# EAGLE design untitled (EAGLE 7.7.0)
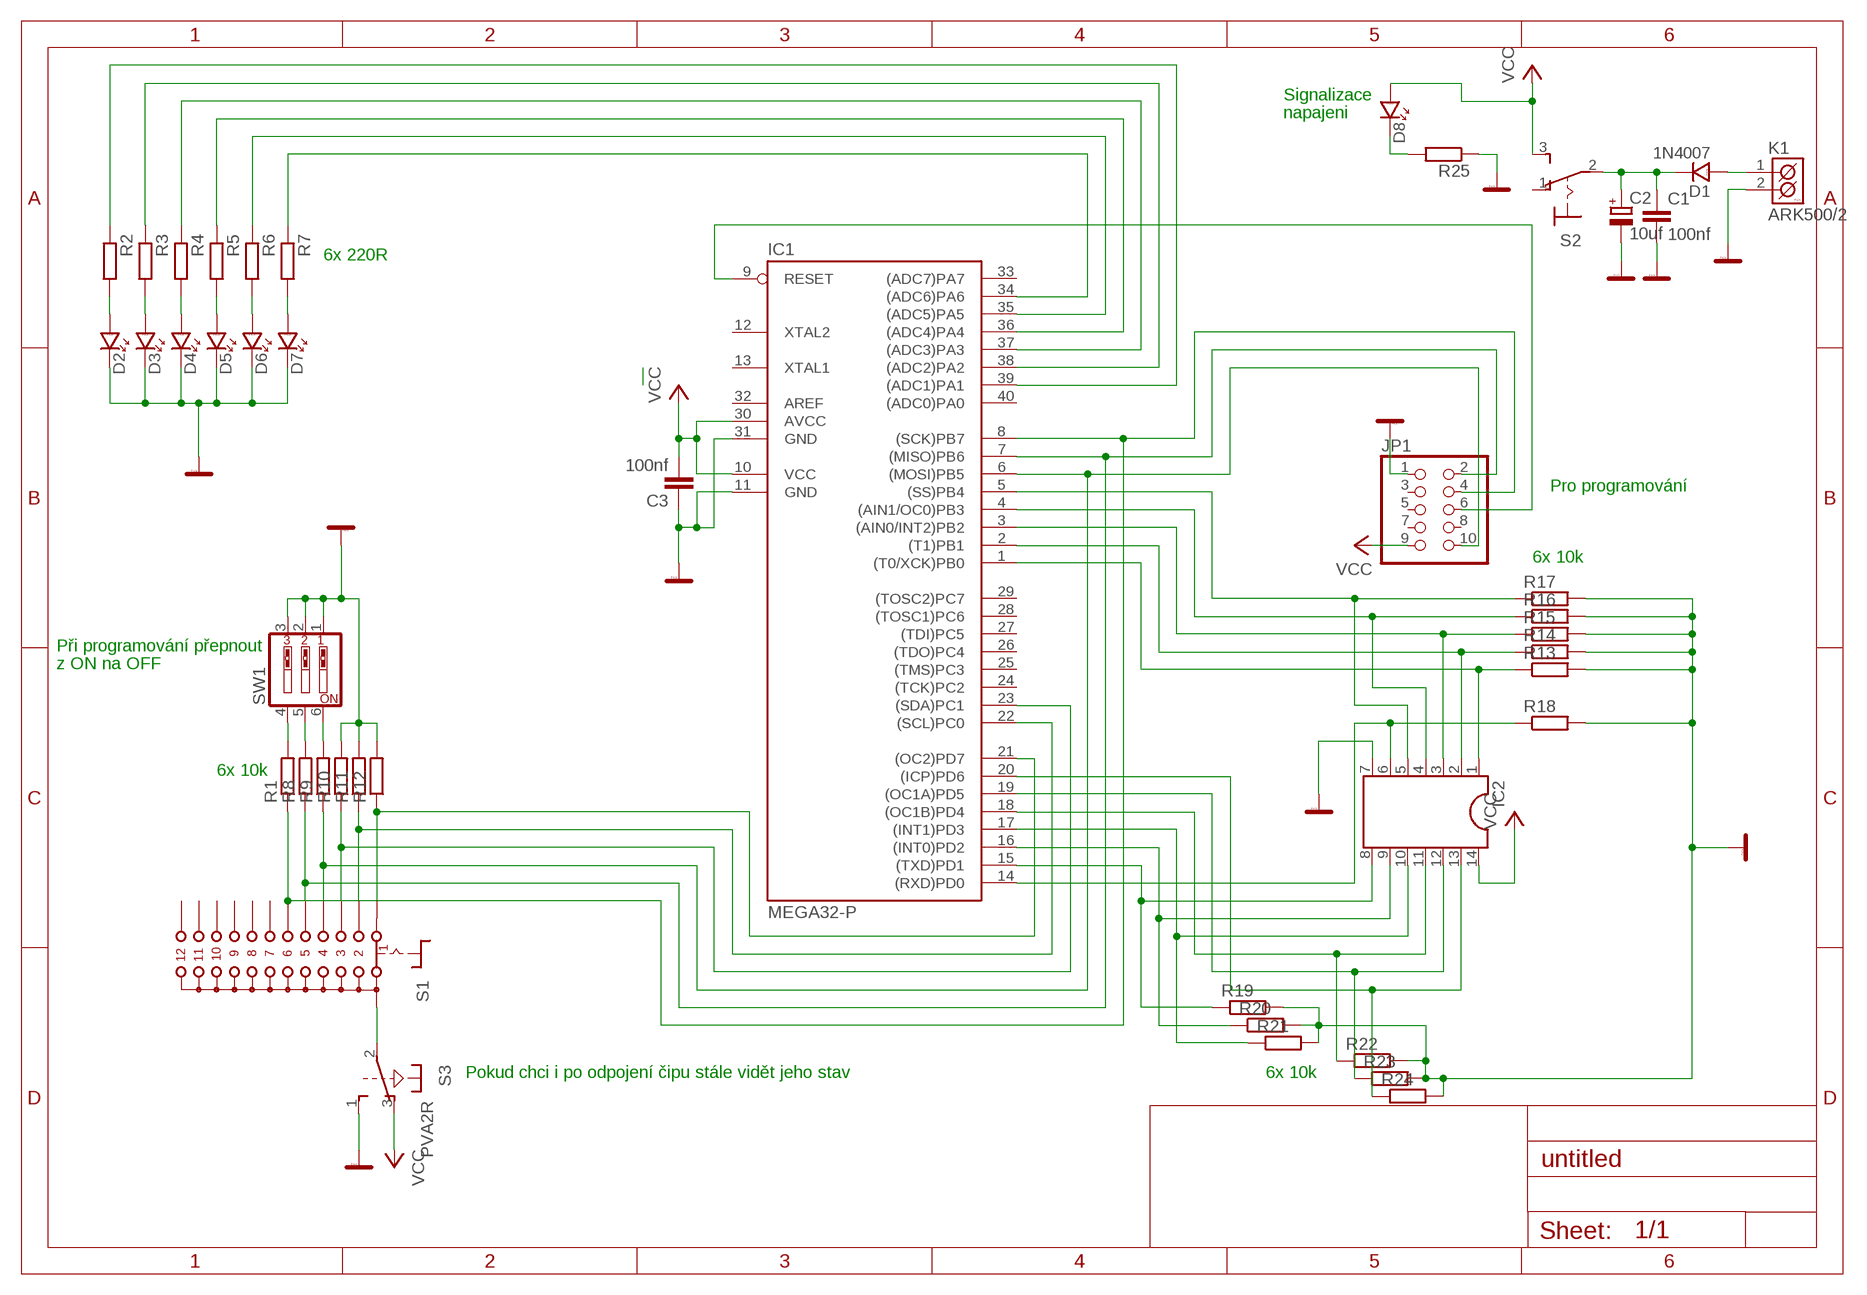
[diagram p0: schematic, sheet 1]

## Parts
C1  100nf  C-EU050-025X075  [C050-025X075]
C2  10uf  CPOL-EUE5-8.5  [E5-8,5]
C3  100nf  C-EU050-025X075  [C050-025X075]
D1  1N4007  [DO41]
D2  LED_5  [LED_5]
D3  LED_5  [LED_5]
D4  LED_5  [LED_5]
D5  LED_5  [LED_5]
D6  LED_5  [LED_5]
D7  LED_5  [LED_5]
D8  LED_5  [LED_5]
IC1  MEGA32-P  [DIL40]
IC2  DIL14  [DIL14]
JP1  PINHD-2X5  [2X05]
K1  ARK500/2  [ARK500/2]
R1  R-EU_0207/10  [0207/10]
R2  R-EU_0207/10  [0207/10]
R3  R-EU_0207/10  [0207/10]
R4  R-EU_0207/10  [0207/10]
R5  R-EU_0207/10  [0207/10]
R6  R-EU_0207/10  [0207/10]
R7  R-EU_0207/10  [0207/10]
R8  R-EU_0207/10  [0207/10]
R9  R-EU_0207/10  [0207/10]
R10  R-EU_0207/10  [0207/10]
R11  R-EU_0207/10  [0207/10]
R12  R-EU_0207/10  [0207/10]
R13  R-EU_0207/10  [0207/10]
R14  R-EU_0207/10  [0207/10]
R15  R-EU_0207/10  [0207/10]
R16  R-EU_0207/10  [0207/10]
R17  R-EU_0207/10  [0207/10]
R18  R-EU_0207/10  [0207/10]
R19  R-EU_0207/10  [0207/10]
R20  R-EU_0207/10  [0207/10]
R21  R-EU_0207/10  [0207/10]
R22  R-EU_0207/10  [0207/10]
R23  R-EU_0207/10  [0207/10]
R24  R-EU_0207/10  [0207/10]
R25  R-EU_0207/10  [0207/10]
S1  CK101X12  [CK101X12]
S2  320-916  [320-916]
S3  PVA2R  [PVA2R]
SW1  SW_DIP-3  [EDG-03]

## Nets
GND: C1.2 C2.- C3.1 D2.K D3.K D4.K D5.K D6.K D7.K IC1.11(GND) IC1.31(GND) IC2.7 JP1.1 K1.2(K2) R10.2 R11.2 R12.2 R13.2 R14.2 R15.2 R16.2 R17.2 R18.2 R19.2 R20.2 R21.2 R22.2 R23.2 R24.2 R25.1 S3.1(1:S) SW1.1 SW1.2 SW1.3
N$1: R1.2 SW1.4
N$3: D2.A R2.2
N$4: D3.A R3.2
N$5: D4.A R4.2
N$6: S1.A S3.2(1:P)
N$7: IC1.1((T0/XCK)PB0) IC2.1 R13.1
N$8: IC1.8((SCK)PB7) JP1.4 R1.1 S1.6
N$9: IC1.9(RESET) JP1.6
N$10: D5.A R5.2
N$11: R8.2 SW1.5
N$12: R9.2 SW1.6
N$13: D6.A R6.2
N$14: D7.A R7.2
N$15: IC1.39((ADC1)PA1) R2.1
N$16: IC1.38((ADC2)PA2) R3.1
N$17: IC1.37((ADC3)PA3) R4.1
N$18: IC1.36((ADC4)PA4) R5.1
N$19: IC1.35((ADC5)PA5) R6.1
N$20: IC1.34((ADC6)PA6) R7.1
N$21: IC1.2((T1)PB1) IC2.2 R14.1
N$22: IC1.7((MISO)PB6) JP1.2 R8.1 S1.5
N$23: IC1.6((MOSI)PB5) JP1.10 R9.1 S1.4
N$24: IC1.23((SDA)PC1) R10.1 S1.3
N$25: IC1.22((SCL)PC0) R11.1 S1.2
N$26: IC1.21((OC2)PD7) R12.1 S1.1
N$27: IC1.3((AIN0/INT2)PB2) IC2.3 R15.1
N$28: IC1.4((AIN1/OC0)PB3) IC2.4 R16.1
N$29: IC1.5((SS)PB4) IC2.5 R17.1
N$30: IC1.14((RXD)PD0) IC2.6 R18.1
N$31: C1.1 C2.+ D1.K S2.2(P)
N$32: D1.A K1.1(K1)
N$33: IC1.15((TXD)PD1) IC2.8 R19.1
N$34: IC1.16((INT0)PD2) IC2.9 R20.1
N$35: IC1.17((INT1)PD3) IC2.10 R21.1
N$36: IC1.18((OC1B)PD4) IC2.11 R22.1
N$37: IC1.19((OC1A)PD5) IC2.12 R23.1
N$38: IC1.20((ICP)PD6) IC2.13 R24.1
N$39: D8.K R25.2
VCC: C3.2 D8.A IC1.10(VCC) IC1.30(AVCC) IC2.14 JP1.9 S2.3(S) S3.3(1:O)
Unconnected: IC1.12(XTAL2) IC1.13(XTAL1) IC1.24((TCK)PC2) IC1.25((TMS)PC3) IC1.26((TDO)PC4) IC1.27((TDI)PC5) IC1.28((TOSC1)PC6) IC1.29((TOSC2)PC7) IC1.32(AREF) IC1.33((ADC7)PA7) IC1.40((ADC0)PA0) JP1.3 JP1.5 JP1.7 JP1.8 S1.7 S1.8 S1.9 S1.10 S1.11 S1.12 S2.1(O) S3.4(2:S) S3.5(2:P) S3.6(2:O)

## Notes on the sheet
- Signalizace
- napajeni
- 6x 220R
- Pro programování
- 6x 10k
- Při programování přepnout
- z ON na OFF
- 6x 10k
- Pokud chci i po odpojení čipu stále vidět jeho stav | 6x 10k

## Library data of the parts
C1 C3 = rcl:C-EU: CAPACITOR, European symbol
C2 = rcl:CPOL-EU: POLARIZED CAPACITOR, European symbol
D1 = #PaJa_31:1N4007: Usmernovaci dioda - 1A, 1000V
D2-D8 = #PaJa_31:LED: LED - jednobarevna
IC1 = atmel:MEGA32-P: MICROCONTROLLER 32 Kbytes FLASH 2 Kbytes SRAM 1 Kbytes EEPROM USART 8-channel 10 bit ADC Source: www.atmel.com .. doc2503.pdf; MPN: ATMEGA32-16PU; OC_FARNELL: 1661729; OC_NEWARK: 51P1794
IC2 = ic-package:DIL14: Dual In Line / Socket
JP1 = pinhead:PINHD-2X5: PIN HEADER
K1 = #PaJa_konektory:ARK500/2: Svorkovnice - roztec 5mm - dvojita
R1 R8-R25 = resistor:R-EU_: RESISTOR, European symbol
R2-R7 = rcl:R-EU_: RESISTOR, European symbol
S1 = switch:CK101X12: ROTARY SWITCH C&K
S2 = switch:320-916: TOGGLE SWITCH distributor RS Components
S3 = switch-misc:PVA2R: ITT SWITCH
SW1 = special:SW_DIP-3: DIP SWITCH

## Board
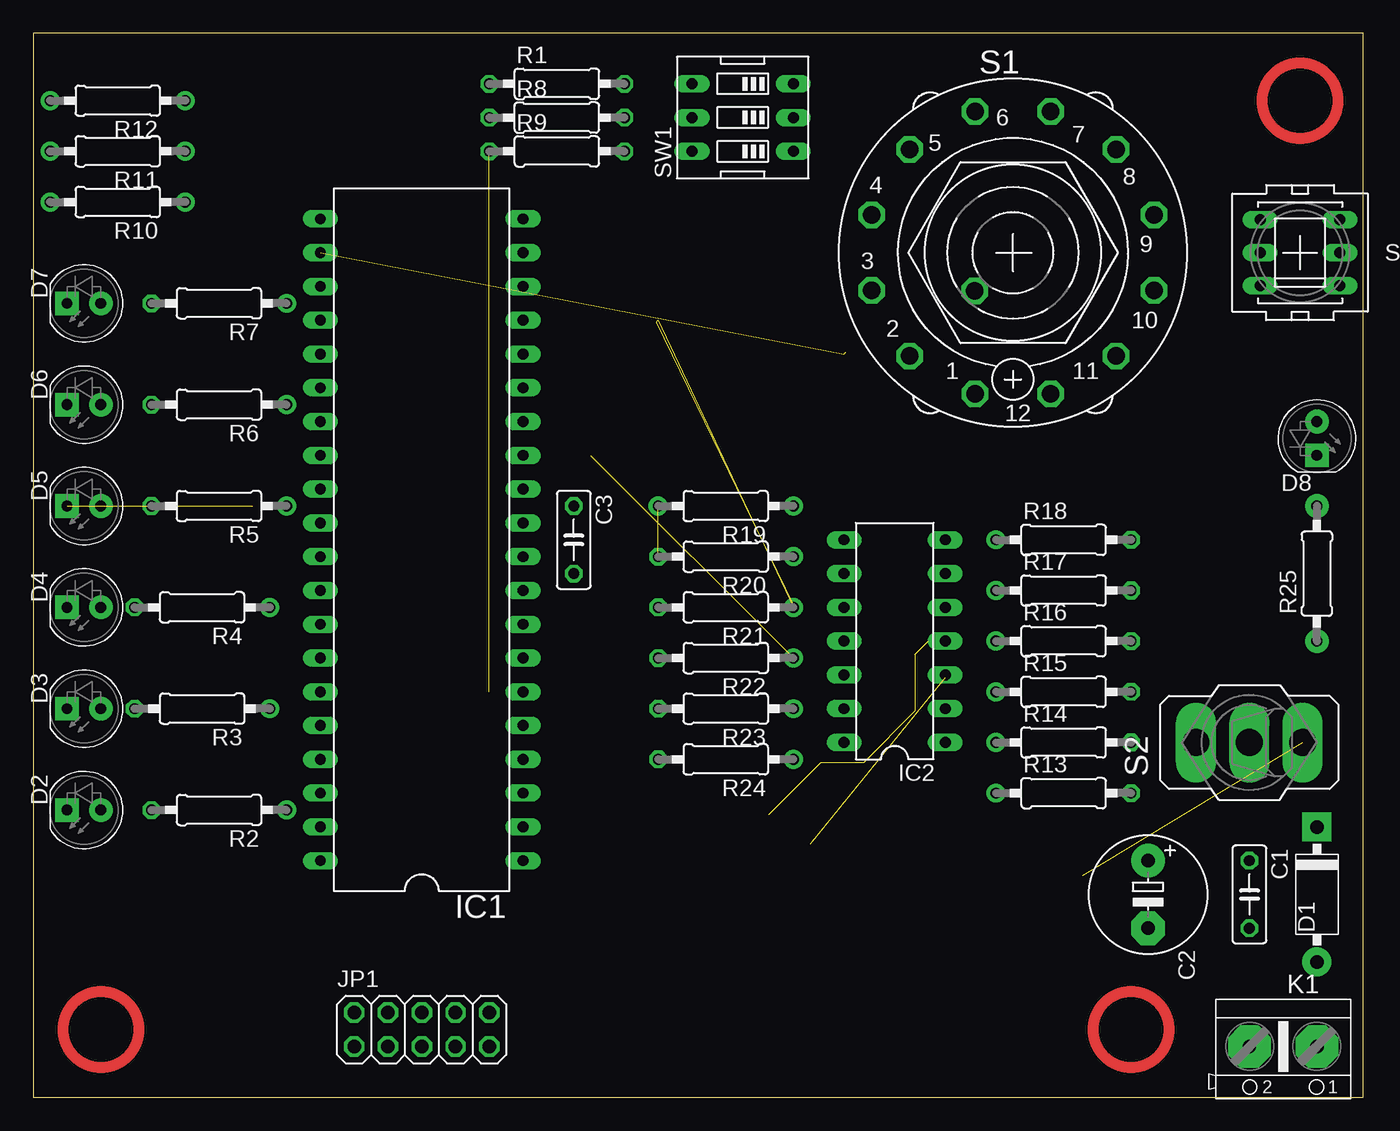
[diagram p1: board, top side]
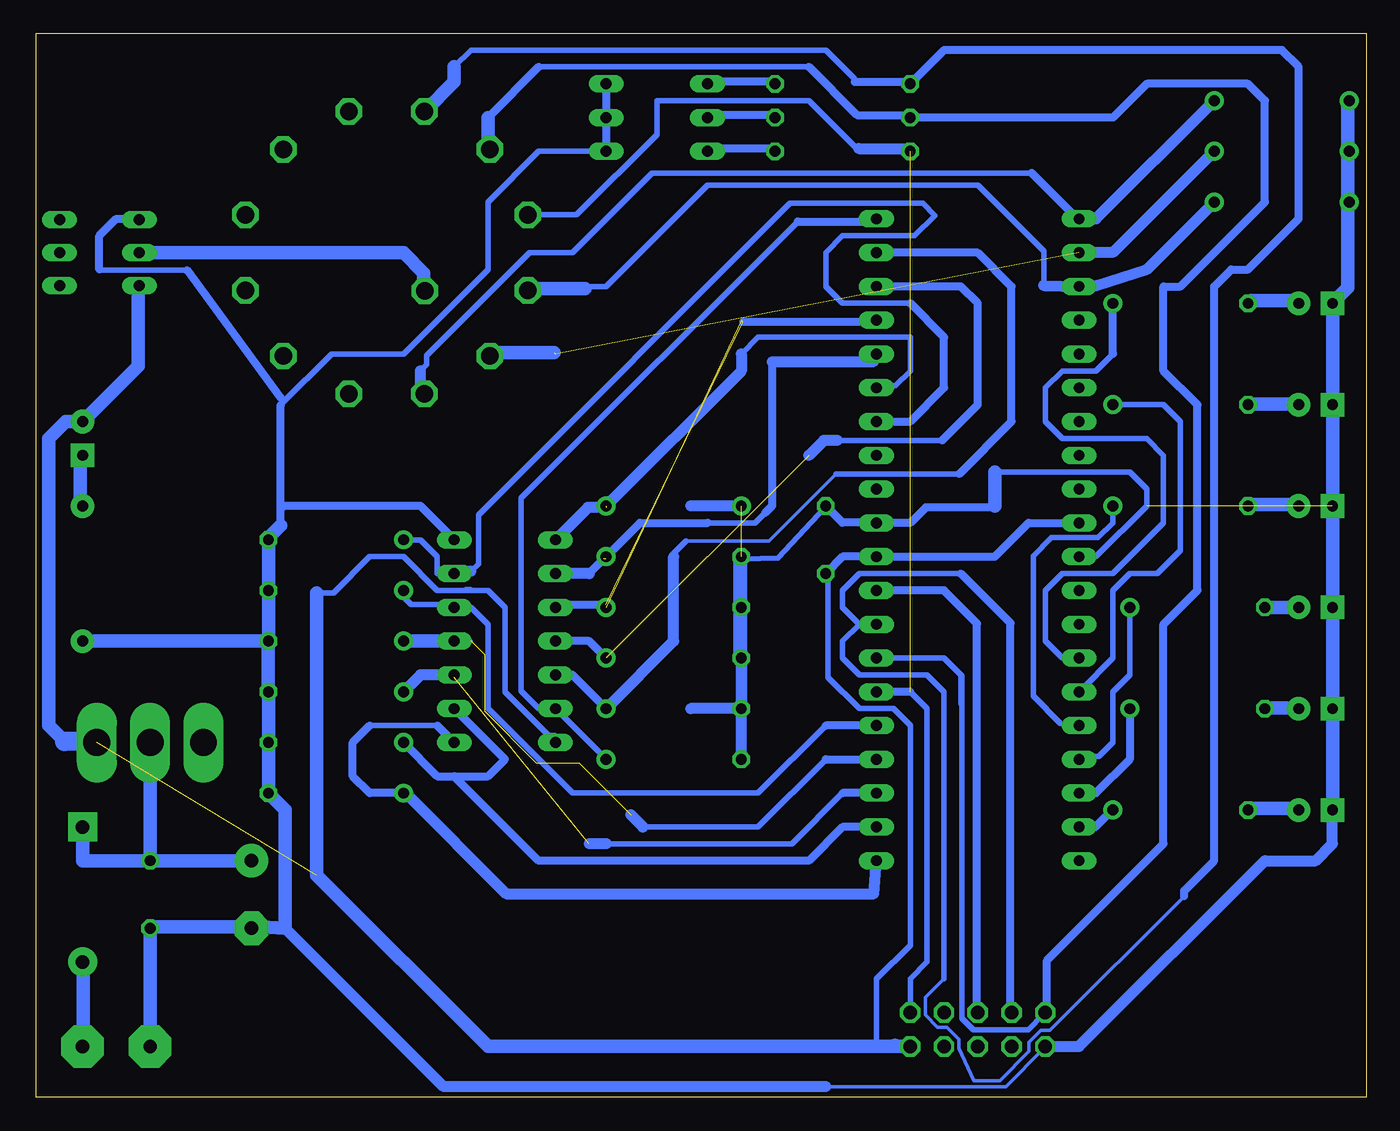
[diagram p2: board, bottom side, seen from below]

Size 100 x 80 mm. Coordinates in mm from the lower left corner, seen from the top.
Outline: 0,0 100,0 100,80 0,80 0,0
Copper layers (1*16): Top 0.035mm / dielectric 1.5mm / Bottom 0.035mm
Design rules "default": minimum track width 10mil, minimum drill 24mil, track to track 8mil, track to pad 8mil, pad to pad 8mil, via to via 8mil, smd to smd 8mil, copper to edge 40mil, drill to drill 8mil, minimum pad ring 10mil, minimum via ring 8mil, stop-mask expansion 4mil, vias tented up to drill 0mil, thermal gap 10mil

### Footprints (pad centres in the part's own frame; a part is rotated, then mirrored left to right if it is on the bottom)
C050-025X075 = drill 0.813 octagon: 1 -2.54,0; 2 2.54,0
E5-8,5 = drill 1.016 pad 2.54: + -2.54,0 | drill 1.016 pad 2.54 octagon: - 2.54,0
DO41 = drill 1.016 pad 2.184: A -5.08,0 | drill 1.016 pad 2.184 square: K 5.08,0
LED_5 = drill 0.813 pad 1.778: A -1.27,0 | drill 0.813 pad 1.778 square: K 1.27,0
DIL40 = drill 0.813 long: 1 -24.13,-7.62; 2 -21.59,-7.62; 3 -19.05,-7.62; 4 -16.51,-7.62; 5 -13.97,-7.62; 6 -11.43,-7.62; 7 -8.89,-7.62; 8 -6.35,-7.62; 9 -3.81,-7.62; 10 -1.27,-7.62; 11 1.27,-7.62; 12 3.81,-7.62; 13 6.35,-7.62; 14 8.89,-7.62; 15 11.43,-7.62; 16 13.97,-7.62; 17 16.51,-7.62; 18 19.05,-7.62; 19 21.59,-7.62; 20 24.13,-7.62; 21 24.13,7.62; 22 21.59,7.62; 23 19.05,7.62; 24 16.51,7.62; 25 13.97,7.62; 26 11.43,7.62; 27 8.89,7.62; 28 6.35,7.62; 29 3.81,7.62; 30 1.27,7.62; 31 -1.27,7.62; 32 -3.81,7.62; 33 -6.35,7.62; 34 -8.89,7.62; 35 -11.43,7.62; 36 -13.97,7.62; 37 -16.51,7.62; 38 -19.05,7.62; 39 -21.59,7.62; 40 -24.13,7.62
DIL14 = drill 0.813 long: 1 -7.62,-3.81; 2 -5.08,-3.81; 3 -2.54,-3.81; 4 0,-3.81; 5 2.54,-3.81; 6 5.08,-3.81; 7 7.62,-3.81; 8 7.62,3.81; 9 5.08,3.81; 10 2.54,3.81; 11 0,3.81; 12 -2.54,3.81; 13 -5.08,3.81; 14 -7.62,3.81
2X05 = drill 1.016 octagon: 1 -5.08,-1.27; 2 -5.08,1.27; 3 -2.54,-1.27; 4 -2.54,1.27; 5 0,-1.27; 6 0,1.27; 7 2.54,-1.27; 8 2.54,1.27; 9 5.08,-1.27; 10 5.08,1.27
ARK500/2 = drill 1 pad 3.2 octagon: 1 -2.54,0; 2 2.54,0
0207/10 = drill 0.813 octagon: 1 -5.08,0; 2 5.08,0
CK101X12 = drill 1.321 octagon: 1 -2.845,-10.617; 2 -7.772,-7.772; 3 -10.617,-2.845; 4 -10.617,2.845; 5 -7.772,7.772; 6 -2.845,10.617; 7 2.845,10.617; 8 7.772,7.772; 9 10.617,2.845; 10 10.617,-2.845; 11 7.772,-7.772; 12 2.845,-10.617; A -2.87,-2.87
320-916 = drill 2.007 long: 1 0,4.013; 2 0,0; 3 0,-4.013
PVA2R = drill 0.813 long: 1 -2.997,2.489; 2 -2.997,0; 3 -2.997,-2.489; 4 2.997,2.489; 5 2.997,0; 6 2.997,-2.489
EDG-03 = drill 0.813 long: 1 -2.54,-3.81; 2 0,-3.81; 3 2.54,-3.81; 4 2.54,3.81; 5 0,3.81; 6 -2.54,3.81

### Placement (x,y rotation side)
C1  91.44,15.24 270 top
C2  83.82,15.24 270 top
C3  40.64,41.91 270 top
D1  96.52,15.24 90 top
D2  3.81,21.59 180 top
D3  3.81,29.21 180 top
D4  3.81,36.83 180 top
D5  3.81,44.45 180 top
D6  3.81,52.07 180 top
D7  3.81,59.69 180 top
D8  96.52,49.53 270 top
IC1  29.21,41.91 90 top
IC2  64.77,34.29 90 top
JP1  29.21,5.08 0 top
K1  93.98,3.81 180 top
R1  39.37,76.2 0 top
R2  13.97,21.59 180 top
R3  12.7,29.21 180 top
R4  12.7,36.83 180 top
R5  13.97,44.45 180 top
R6  13.97,52.07 180 top
R7  13.97,59.69 180 top
R8  39.37,73.66 0 top
R9  39.37,71.12 0 top
R10  6.35,67.31 180 top
R11  6.35,71.12 180 top
R12  6.35,74.93 180 top
R13  77.47,22.86 0 top
R14  77.47,26.67 0 top
R15  77.47,30.48 0 top
R16  77.47,34.29 0 top
R17  77.47,38.1 0 top
R18  77.47,41.91 0 top
R19  52.07,44.45 180 top
R20  52.07,40.64 180 top
R21  52.07,36.83 180 top
R22  52.07,33.02 180 top
R23  52.07,29.21 180 top
R24  52.07,25.4 180 top
R25  96.52,39.37 90 top
S1  73.66,63.5 0 top
S2  91.44,26.67 90 top
S3  95.25,63.5 0 top
SW1  53.34,73.66 90 top

### Tracks (layer width: path | path; a pad name or v marks a point on that pad's centre or on a via)
GND  (2 unrouted)
  Bottom 0.254: 1.37,67.44 R10.2 1.37,67.21 | 1.37,71.09 R11.2 1.37,71.32 | 1.37,74.75 R12.2 | 2.52,37.03 D4.K | 2.52,44.35 D5.K 2.52,44.58 | 2.52,51.89 D6.K 2.52,52.12 | 2.52,59.66 D7.K 2.52,59.89 | 24,3.89 JP1.1 24.23,3.66 27.1,0.79 40.64,0.79 | 2.74,21.49 D2.K 2.52,21.72 | 2.52,29.03 D3.K 2.52,29.26 | 40.46,44.35 C3.1 40.69,44.35 | 37.03,43.2 IC1.11 | 47.09,33.15 R22.2 | 47.09,36.8 R21.2 47.09,37.03 | 47.09,40.46 R20.2 46.86,40.46 | 91.44,12.8 C1.2 | 83.9,12.8 C2.- | 82.53,26.52 R14.2 82.53,26.75 | 82.53,30.63 R15.2 82.53,30.4 | 82.53,38.18 R17.2 82.53,37.95 | 82.53,41.83 R18.2 82.53,42.06 | 81.61,42.98 81.61,43.18 | 81.61,52.07 81.61,52.58 | 92.35,65.84 S3.1 | 82.53,34.29 R16.2 | 82.07,22.4 82.53,22.86 R13.2 | 83.67,12.8 C2.- | 83.67,12.57 C2.-
  Bottom 0.406: 40.69,44.35 44.25,40.54 46.86,40.46 | IC2.7 68.73,42.06 | SW1.1 62.23,71.12 66.04,67.31 66.04,62.23 72.39,55.88 77.8,55.88 81.61,52.07 | IC1.31 20.32,40.64 16.51,44.45 16.51,45.72 17.78,46.99 27.94,46.99 | 81.61,43.18 81.61,44.12 81.28,44.45 | 88.67,62.18 95.2,62.18 95.25,62.23 | 92.3,66.04 S3.1
  Bottom 0.61: 81.61,52.58 88.67,62.18 | 81.61,43.18 81.61,52.07 | SW1.3 SW1.2 SW1.1 | 27.94,44.45 28.04,44.35 33.12,44.35 34.29,43.18 IC1.11 | 95.25,62.23 95.25,64.77 93.98,66.04 92.3,66.04 | 68.58,42.06 68.73,42.06 71.12,44.45 81.28,44.45 | 37.03,43.2 39.4,43.2 C3.1
  Bottom 0.813: JP1.1 21.59,3.81 7.62,17.78 3.81,17.78 2.54,19.05 D2.K | 40.64,0.79 69.37,0.79 81.28,12.7 | R24.2 R23.2 | R23.2 R22.2 | R19.2 50.8,44.45 | R20.2 R23.2 | R23.2 50.8,29.21
  Bottom 1.016: 1.37,74.75 1.37,71.22 R11.2 | 1.37,71.09 1.37,67.41 R10.2 | 1.37,67.21 1.37,60.86 D7.K | 2.52,59.66 2.52,52.09 D6.K | 2.52,21.72 2.52,29.18 D3.K | 2.52,29.26 2.52,36.8 D4.K | 2.52,37.03 2.52,44.42 D5.K 2.52,44.48 2.52,51.89 | 83.67,12.8 83.67,12.85 81.28,12.7 81.28,21.59 R13.2 | 82.53,22.86 82.53,26.64 R14.2 | 82.53,26.75 82.53,30.45 R15.2 R16.2 | 81.61,42.98 82.53,42.06 82.53,41.83 82.53,38.12 R17.2 | 82.53,37.95 82.53,34.31 R16.2 | R16.2 R25.1 | 47.09,33.15 47.09,36.73 R21.2 | 47.09,37.03 47.09,40.54 R20.2 | 83.9,12.8 91.34,12.8 C1.2 K1.2 | 27.94,44.45 27.94,46.99
N$1
  Bottom 0.254: 44.58,76.35 R1.2
  Bottom 0.61: 44.58,76.35 49.38,76.35 SW1.4
N$3
  Bottom 0.254: 8.69,21.72 R2.2 | 5.26,21.72 D2.A
  Bottom 1.016: 5.26,21.72 8.76,21.72 R2.2
N$4
  Bottom 0.254: 5.26,29.26 D3.A
  Bottom 1.016: 5.26,29.26 7.57,29.26 R3.2
N$5
  Bottom 1.016: D4.A R4.2
N$6
  Bottom 0.254: 92.13,63.32 S3.2 | 70.87,60.81 S1.A
  Bottom 1.016: 70.87,60.81 70.87,61.98 72.39,63.5 S3.2
N$7
  Bottom 0.254: 72.24,22.86 R13.1 72.47,22.86 | 68.58,26.75 IC2.1
  Bottom 0.406: 68.58,26.75 68.66,26.75 | 69.85,27.94 74.93,27.94
  Bottom 0.61: 68.66,26.75 69.85,27.94 | 72.47,22.86 74.93,22.86 76.2,24.13 76.2,26.67 74.93,27.94
  Bottom 0.813: 72.24,22.86 64.67,15.29 37.03,15.29 IC1.1
N$8
  Bottom 0.254: 26.75,6.4 JP1.4 | 13.69,15.11 23.77,5.03 24.46,5.03 25.38,4.12 25.38,3.43 27.56,1.25 29.49,1.25 30.63,3.66 30.63,4.34 31.55,5.26 32.23,5.26 33.15,6.17 33.15,7.49 31.75,8.89 | 34.29,76.35 R1.1 | 37.03,35.43 IC1.8
  Bottom 0.406: 30.48,39.37 38.1,39.37 39.37,38.1 39.37,36.83 38.1,35.56 | IC1.8 38.1,35.56 | 38.1,35.56 39.37,34.29 39.37,33.02 38.1,31.75 33.02,31.75 31.75,30.48 31.75,8.89 | 38.48,76.35 38.48,76.58 40.64,78.74 67.31,78.74 68.58,77.47
  Bottom 0.61: 38.48,76.35 34.29,76.35 | 26.75,6.4 26.75,35.64 30.48,39.37 | R1.1 31.75,78.74 6.35,78.74 5.08,77.47 5.08,66.04 8.89,62.23 10.16,62.23 11.43,60.96 11.43,17.78 13.69,15.52 13.69,15.11
  Bottom 1.016: 68.58,77.47 68.58,76.35 S1.6
N$9
  Bottom 0.254: 36.8,37.95 IC1.9 | 29.26,6.4 JP1.6
  Bottom 0.61: 29.26,6.4 29.26,35.61 31.75,38.1 IC1.9
N$10
  Bottom 0.254: 8.69,44.58 R5.2 | 5.26,44.58 D5.A
  Bottom 1.016: 5.26,44.58 8.76,44.58 R5.2
N$11
  Bottom 0.254: 44.58,73.84 R8.2 | 49.38,73.84 SW1.5
  Bottom 0.61: 44.58,73.84 49.35,73.84 SW1.5
N$12
  Bottom 0.254: 44.58,71.32 R9.2 | 49.38,71.32 SW1.6
  Bottom 0.61: 44.58,71.32 49.33,71.32 SW1.6
N$13
  Bottom 0.254: 8.69,52.12 R6.2 | 5.26,52.12 D6.A
  Bottom 1.016: 5.26,52.12 8.84,52.12 R6.2
N$14
  Bottom 0.254: 5.26,59.89 D7.A
  Bottom 1.016: 5.26,59.89 8.69,59.89 R7.2
N$15
  Bottom 0.254: 20.34,20.34 21.49,20.34 IC1.39 | 19.2,21.49 R2.1
  Bottom 0.61: 19.2,21.49 20.37,20.32 IC1.39
N$16
  Bottom 0.254: 17.93,29.03 R3.1 | 21.49,22.86 IC1.38
  Bottom 0.61: 17.93,29.03 17.78,28.88 17.78,25.4 20.32,22.86 IC1.38
N$17
  Bottom 0.254: 21.49,25.6 IC1.37
  Bottom 0.406: 21.49,25.6 20.12,25.6 19.05,26.67 19.05,30.48 17.78,31.75 R4.1
N$18
  Bottom 0.406: IC1.36 22.99,28.12 25.04,30.18 25.04,40.69 23.67,42.06 20.17,42.06 19.05,43.18 R5.1
N$19
  Bottom 0.254: 21.49,30.63 IC1.35 | 18.97,51.89 R6.1
  Bottom 0.406: R6.1 15.24,52.07 13.97,50.8 13.97,41.1 15.7,39.37 17.78,39.37 19.05,38.1 19.05,33.02 21.44,30.63 21.49,30.63
N$20
  Bottom 0.254: 19.2,59.66 R7.1
  Bottom 0.406: IC1.34 22.86,33.02 24.13,34.29 24.13,38.1 22.86,39.37 19.05,39.37 15.24,43.18 15.24,48.26 16.51,49.53 22.86,49.53 24.13,50.8 24.13,53.34 22.86,54.61 20.32,54.61 19.05,55.88
  Bottom 0.61: 19.05,55.88 R7.1
N$21
  Bottom 0.254: 72.24,26.52 R14.1
  Bottom 0.61: R14.1 69.85,24.13 68.58,24.13 | IC1.2 39.37,20.32 41.91,17.78 62.23,17.78 68.58,24.13 | 68.58,24.13 66.04,24.13 64.77,25.4 IC2.2
  Bottom 0.813: 68.58,29.03 IC2.2
N$22
  Bottom 0.254: 36.35,32.92 36.8,32.92 IC1.7 | 24.23,6.17 JP1.2 24,6.4 | 34.29,73.84 R8.1
  Bottom 0.406: 36.25,33.02 31.75,33.02 30.48,31.75 | 30.48,31.75 30.48,29.59 30.4,29.52 | 41.91,77.47 62.23,77.47 | 30.48,31.75 30.4,31.67 30.4,5.94 29.54,5.08 25.4,5.08 24.31,6.17 24.23,6.17
  Bottom 0.61: 34.29,73.84 38.28,73.84 41.91,77.47 | 34.11,73.84 R8.1 19.05,73.66 16.51,76.2 8.89,76.2 7.62,74.93 7.62,67.31 13.97,60.96 15.24,60.96 15.24,54.61 12.7,52.07 12.7,38.1 15.24,35.56 15.24,19.05 24,10.29 24,6.4 | 36.25,33.02 36.35,32.92 | 62.23,77.47 66.04,73.66
  Bottom 1.016: 66.04,73.66 66.04,71.42 S1.5
N$23  (1 unrouted)
  Bottom 0.254: 34.29,71.32 R9.1 | 36.35,30.4 36.8,30.4 IC1.6
  Bottom 0.406: S1.4 59.38,66.34 53.34,72.39 53.34,74.93 41.91,74.93 38.3,71.32 38.15,71.32 | JP1.10 34.29,8.89 33.02,10.16 33.02,29.21 34.29,30.48 | 36.27,30.48 36.35,30.4
  Bottom 0.61: 34.29,30.48 36.27,30.48
  Bottom 0.813: 38.15,71.32 34.29,71.32
N$24
  Bottom 0.254: 11.43,67.21 R10.1 | 21.49,61.04 IC1.23 | 62.87,60.81 S1.3
  Bottom 0.406: 24.26,61.04 24.26,63.63 29.21,68.58 49.53,68.58 57.15,60.96 58.57,60.96 58.73,60.81
  Bottom 0.813: 24.26,61.04 IC1.23 | 21.49,61.04 20.24,61.04 16.51,62.23 R10.1
  Bottom 1.016: 62.87,60.81 58.73,60.81
N$25  (2 unrouted)
  Bottom 0.254: 11.43,71.09 R11.1 | 21.49,63.55 IC1.22 | 65.84,55.78 S1.2
  Bottom 0.813: 65.84,55.78 66.04,55.98 | 21.49,63.55 19,63.55 R11.1
  Bottom 1.016: 66.04,55.98 61.06,55.98
N$26
  Bottom 0.254: 11.43,74.75 R12.1 | 21.49,66.06 IC1.21 21.72,66.06 | 70.64,53.03 S1.1
  Bottom 0.406: 71.12,54.61 70.64,55.09 70.64,55.78 62.92,63.5 59.69,63.5 53.7,69.49 25.15,69.49
  Bottom 0.61: 21.72,66.06 25.15,69.49
  Bottom 0.813: 70.64,53.03 71.12,53.52 71.12,54.61 | 11.43,74.75 11.61,74.75 20.32,66.04 IC1.21
N$27  (1 unrouted)
  Bottom 0.254: 72.24,30.63 R15.1 | 68.58,31.55 IC2.3
  Bottom 0.406: 39.37,22.86 43.18,19.05 57.15,19.05
  Bottom 0.61: IC1.3 39.37,22.86
  Bottom 0.813: 57.15,19.05 58.42,19.05 | IC2.3 71.12,31.75 R15.1
N$28  (5 unrouted)
  Bottom 0.254: 37.03,25.38 IC1.4 | 67.31,34.29 IC2.4
  Bottom 0.406: 54.38,20.32 45.72,20.32 40.64,25.4
  Bottom 0.61: 40.64,25.4 IC1.4
  Bottom 0.813: 55.3,21.23 54.38,20.32
  Bottom 1.016: IC2.4 R16.1
N$29
  Bottom 0.254: 37.03,27.89 IC1.5 | 68.58,36.8 IC2.5 68.58,37.03 | 72.72,37.95 72.24,37.95 R17.1
  Bottom 0.406: 72.72,37.95 71.81,37.03 68.58,37.03 | 37.03,27.89 37.08,27.94 | 40.64,27.94 45.72,22.86 59.69,22.86 66.04,29.21 66.04,35.56 67.31,36.83 IC2.5
  Bottom 0.61: 37.08,27.94 40.64,27.94
N$30
  Bottom 0.254: 72.24,41.83 R18.1 | 36.8,50.98 IC1.14
  Bottom 0.406: 67.31,39.55 66.75,40.11 66.75,43.79 43.33,67.21 33.35,67.21 32.44,66.29 33.96,64.77 39.37,64.77 40.64,63.5 40.64,60.96 39.37,59.69 34.29,59.69 | R18.1 71.12,41.91 69.85,40.64 69.85,39.37 IC2.6
  Bottom 0.61: IC1.14 34.29,50.8 31.75,53.34 31.75,57.15 34.29,59.69
  Bottom 0.813: 67.31,39.55 IC2.6
N$31
  Bottom 0.254: 96.47,20.12 D1.K | 83.9,17.83 C2.+
  Bottom 1.016: C1.1 96.52,17.78 D1.K | C1.1 C2.+ | S2.2 C1.1
N$32
  Bottom 0.254: 96.47,10.06 D1.A | 96.47,3.89 K1.1
  Bottom 1.016: 96.47,3.89 96.47,10.11 D1.A
N$33  (1 unrouted)
  Bottom 0.254: 60.81,42.06 IC2.8 | 36.8,53.49 IC1.15 | 57.15,44.58 R19.1
  Bottom 0.406: 36.8,53.49 35.41,53.49 34.29,54.61 34.29,57.15 45.72,57.15 46.99,55.88
  Bottom 0.813: 46.99,55.88 46.99,54.61 R19.1 | 57.15,44.35 58.52,44.35 IC2.8
N$34  (1 unrouted)
  Bottom 0.254: 57.15,40.46 R20.1 57.15,40.69 | 60.81,39.55 IC2.9 | 37.03,55.78 IC1.16
  Bottom 0.406: 57.35,40.46 57.35,40.44 | 49.53,43.18 45.95,43.18 45.2,43.93
  Bottom 0.61: 58.42,39.37 R20.1 | 57.15,40.69 57.1,40.69 54.61,43.18 49.53,43.18 | 44.68,55.3 44.68,44.45 45.2,43.93
  Bottom 0.813: 37.03,55.78 37.03,55.32 44.68,55.3 | 58.42,39.37 IC2.9
N$35  (3 unrouted)
  Bottom 0.254: 57.15,37.03 R21.1 | 60.81,37.03 IC2.10 61.04,37.03 61.49,37.03 | 37.03,58.29 IC1.17
  Bottom 0.61: 60.81,37.03 57.35,37.03 R21.1 | 37.03,58.29 46.86,58.29
N$36  (1 unrouted)
  Bottom 0.254: 36.35,60.81 36.8,60.81 IC1.18
  Bottom 0.406: 39.78,49.38 36.12,49.38 31.9,49.38 | 36.2,60.96 36.35,60.81
  Bottom 0.61: 31.9,49.38 29.21,52.07 29.21,59.69 30.48,60.96 IC1.18 | R22.1 58.42,34.29 IC2.11
  Bottom 0.813: 39.78,49.38 40.79,49.38 41.91,48.26
N$37
  Bottom 0.254: 56.79,29.26 57.15,29.26 R23.1 | 60.81,31.55 IC2.12 | 39.88,46.86 44.91,41.83 51.13,41.83
  Bottom 0.406: 52.07,40.64 52.07,40.89 51.13,41.83 | 39.88,46.86 30.61,46.86
  Bottom 0.61: 30.61,46.86 26.67,50.8 26.67,60.96 29.21,63.5 IC1.19 | 56.79,29.26 57.2,29.26 59.69,31.75 IC2.12
  Bottom 0.813: 57.15,29.26 57.1,29.26 52.07,34.29 52.07,40.64
N$38
  Bottom 0.254: 57.15,25.6 R24.1 | 60.81,29.26 IC2.13 | 37.03,65.84 IC1.20
  Bottom 0.406: 42.75,65.84 63.55,45.03 63.55,30.53 62.23,29.21 IC2.13 57.35,25.6 57.15,25.6
  Bottom 0.61: 42.75,65.84 37.03,65.84
N$39
  Bottom 0.254: 96.7,44.58 R25.2 | 96.7,48.23 D8.K
  Bottom 1.016: 96.7,44.58 96.7,48.08 D8.K
N$40  (via drill 0.7 pad 1.42)
  other vias: 1.27,74.93
N$41  (via drill 0.7 pad 1.42)
  other vias: 1.27,71.12
N$42  (via drill 0.7 pad 1.42)
  other vias: 1.27,67.31
N$43  (via drill 0.7 pad 1.42)
  other vias: 11.43,74.93
N$44  (via drill 0.7 pad 1.42)
  other vias: 11.43,71.12
N$45  (via drill 0.7 pad 1.42)
  other vias: 11.43,67.31
N$46  (via drill 0.7 pad 1.42)
  other vias: 19.05,59.69
N$47  (via drill 0.7 pad 1.42)
  other vias: 19.05,52.07
N$48  (via drill 0.7 pad 1.42)
  other vias: 19.05,44.45
N$49  (via drill 0.7 pad 1.42)
  other vias: 17.78,36.83
N$50  (via drill 0.7 pad 1.42)
  other vias: 17.78,29.21
N$51  (via drill 0.7 pad 1.42)
  other vias: 19.05,21.59
N$52  (via drill 0.7 pad 1.42)
  other vias: 46.99,44.45
N$53  (via drill 0.7 pad 1.42)
  other vias: 57.15,44.45
N$54  (via drill 0.7 pad 1.42)
  other vias: 57.15,40.64
N$55  (via drill 0.7 pad 1.42)
  other vias: 57.15,36.83
N$56  (via drill 0.7 pad 1.42)
  other vias: 57.15,33.02
N$57  (via drill 0.7 pad 1.42)
  other vias: 57.15,29.21
N$58  (via drill 0.7 pad 1.42)
  other vias: 57.15,25.4
N$59  (via drill 0.7 pad 1.42)
  other vias: 72.39,41.91
N$60  (via drill 0.7 pad 1.42)
  other vias: 72.39,38.1
N$61  (via drill 0.7 pad 1.42)
  other vias: 72.39,34.29
N$62  (via drill 0.7 pad 1.42)
  other vias: 72.39,30.48
N$63  (via drill 0.7 pad 1.42)
  other vias: 72.39,26.67
N$64  (via drill 0.7 pad 1.42)
  other vias: 72.39,22.86
N$65  (via drill 0.7 pad 1.42)
  other vias: 96.52,44.45
N$66  (via drill 0.6 pad 1.02)
  other vias: 40.64,39.37
N$67  (via drill 0.6 pad 1.02)
  other vias: 40.64,44.45
N$68  (via drill 1.6 pad 2.54)
  other vias: 87.63,26.67
N$69  (via drill 1.1 pad 2.54)
  other vias: 91.44,26.67
N$70  (via drill 1.1 pad 2.54)
  other vias: 95.25,26.67
N$71  (via drill 0.8 pad 1.78)
  other vias: 96.52,44.45
N$72  (via drill 0.8 pad 1.78)
  other vias: 96.52,34.29
VCC  (1 unrouted)
  Bottom 0.254: 37.03,40.46 IC1.10 | 21.72,42.98 IC1.30 | 61.04,27.2 61.04,26.75 IC2.14 | 40.46,39.32 C3.2 | 92.35,60.81 S3.3 | 96.47,50.98 D8.A 96.7,50.75 | 95.56,26.75 S2.3
  Bottom 0.406: 78.92,37.92 77.65,37.92 74.93,40.64 72.39,40.64 69.85,38.1 67.31,38.1 | 37.03,40.46 37.21,40.64 | 61.04,27.2 61.49,27.2 64.77,30.48 64.77,36.83 66.04,38.1 67.31,38.1 | 67.67,38.18 67.39,38.18 67.31,38.1 | 40.46,39.32 40.46,31.57 38.1,29.21 35.56,29.21 34.29,27.94 34.29,11.43 36.83,8.89 36.83,3.81
  Bottom 0.61: IC1.10 27.94,40.64 25.4,43.18 IC1.30 | 37.21,40.64 39.37,40.64 C3.2
  Bottom 1.016: 97.87,26.75 99.06,27.94 99.06,49.53 97.79,50.8 D8.A 92.35,54.97 92.35,60.81 | JP1.9 35.36,3.81 35.43,3.89 35.51,3.81 36.83,3.81 66.04,3.81 78.92,16.69 78.92,37.92
  Bottom 1.422: 95.56,26.75 97.87,26.75
(copper drawn outside any net)
  shapes: Top circle x3